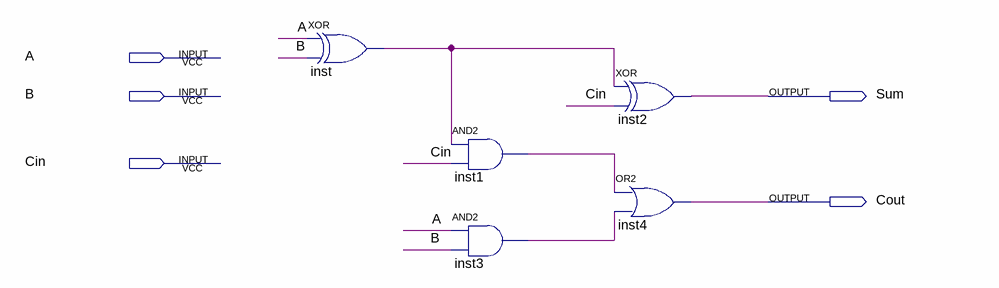
[diagram p0: schematic sheet]
// Quartus schematic a05_add1.bdf as structural Verilog: 5 symbols, 5 pins
module a05_add1 (
  input  A,
  input  B,
  input  Cin,
  output Sum,
  output Cout
);

  wire inst1_out, inst3_out, inst_out;

  xor inst (inst_out, A, B);
  and inst1 (inst1_out, inst_out, Cin);
  and inst3 (inst3_out, A, B);
  xor inst2 (Sum, inst_out, Cin);
  or inst4 (Cout, inst1_out, inst3_out);
endmodule
